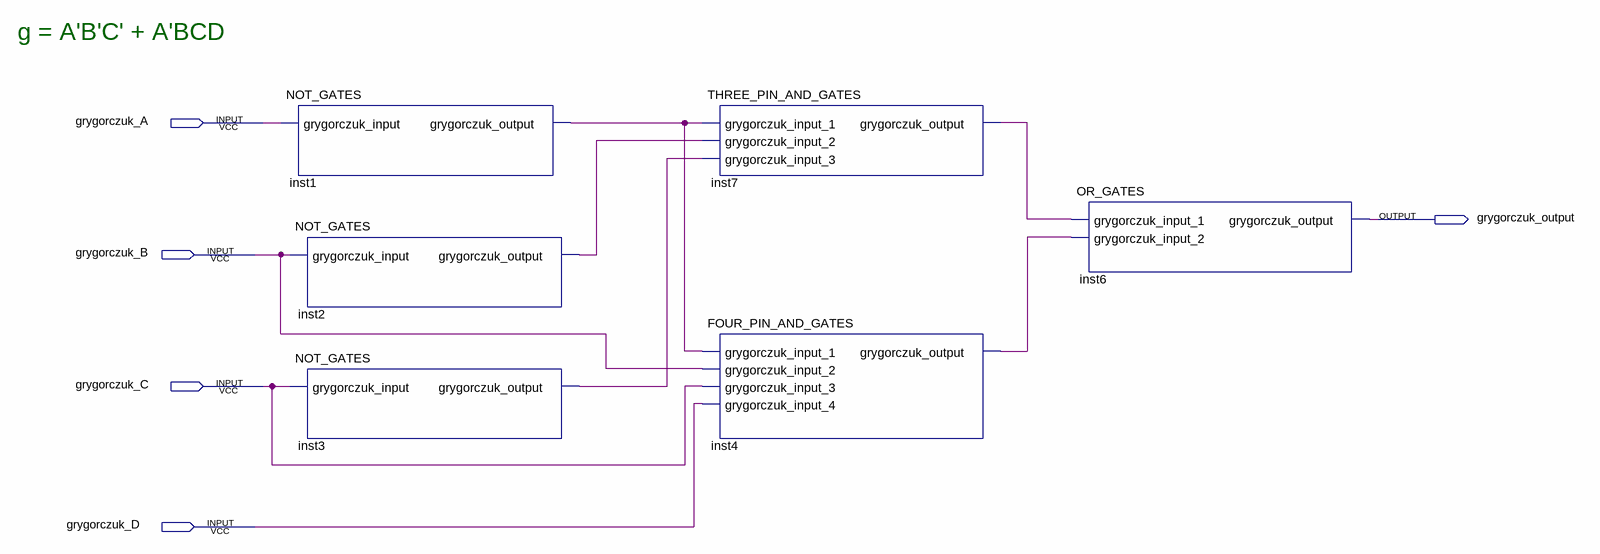
[diagram p0: schematic sheet]
// Quartus schematic SEVEN_SEGMENT_DISPLAY_NAND_G.bdf as structural Verilog: 6 symbols, 5 pins
module SEVEN_SEGMENT_DISPLAY_NAND_G (
  input  grygorczuk_A,
  input  grygorczuk_B,
  input  grygorczuk_C,
  input  grygorczuk_D,
  output grygorczuk_output
);

  wire inst1_grygorczuk_output, inst2_grygorczuk_output, inst3_grygorczuk_output, inst4_grygorczuk_output,
       inst7_grygorczuk_output;

  NOT_GATES inst1 (.grygorczuk_input(grygorczuk_A), .grygorczuk_output(inst1_grygorczuk_output));
  NOT_GATES inst2 (.grygorczuk_input(grygorczuk_B), .grygorczuk_output(inst2_grygorczuk_output));
  NOT_GATES inst3 (.grygorczuk_input(grygorczuk_C), .grygorczuk_output(inst3_grygorczuk_output));
  THREE_PIN_AND_GATES inst7 (
    .grygorczuk_input_1(inst1_grygorczuk_output), .grygorczuk_input_2(inst2_grygorczuk_output),
    .grygorczuk_input_3(inst3_grygorczuk_output), .grygorczuk_output(inst7_grygorczuk_output));
  FOUR_PIN_AND_GATES inst4 (
    .grygorczuk_input_1(inst1_grygorczuk_output), .grygorczuk_input_2(grygorczuk_B),
    .grygorczuk_input_3(grygorczuk_C), .grygorczuk_input_4(grygorczuk_D),
    .grygorczuk_output(inst4_grygorczuk_output));
  OR_GATES inst6 (
    .grygorczuk_input_1(inst7_grygorczuk_output), .grygorczuk_input_2(inst4_grygorczuk_output),
    .grygorczuk_output(grygorczuk_output));

  // Notes on the sheet:
  //   g = A'B'C' + A'BCD
endmodule
